# EasyEDA Pro project head_control.eprj, schematic Schematic1
Board Name: Board1; Create Date: 2025-10-14; Page Name: Core; Project Name: head_control; Schematic Name: Schematic1; Update Date: 2025-11-11; Company: 嘉立创EDA; Page Size: A4; Version: V1.0
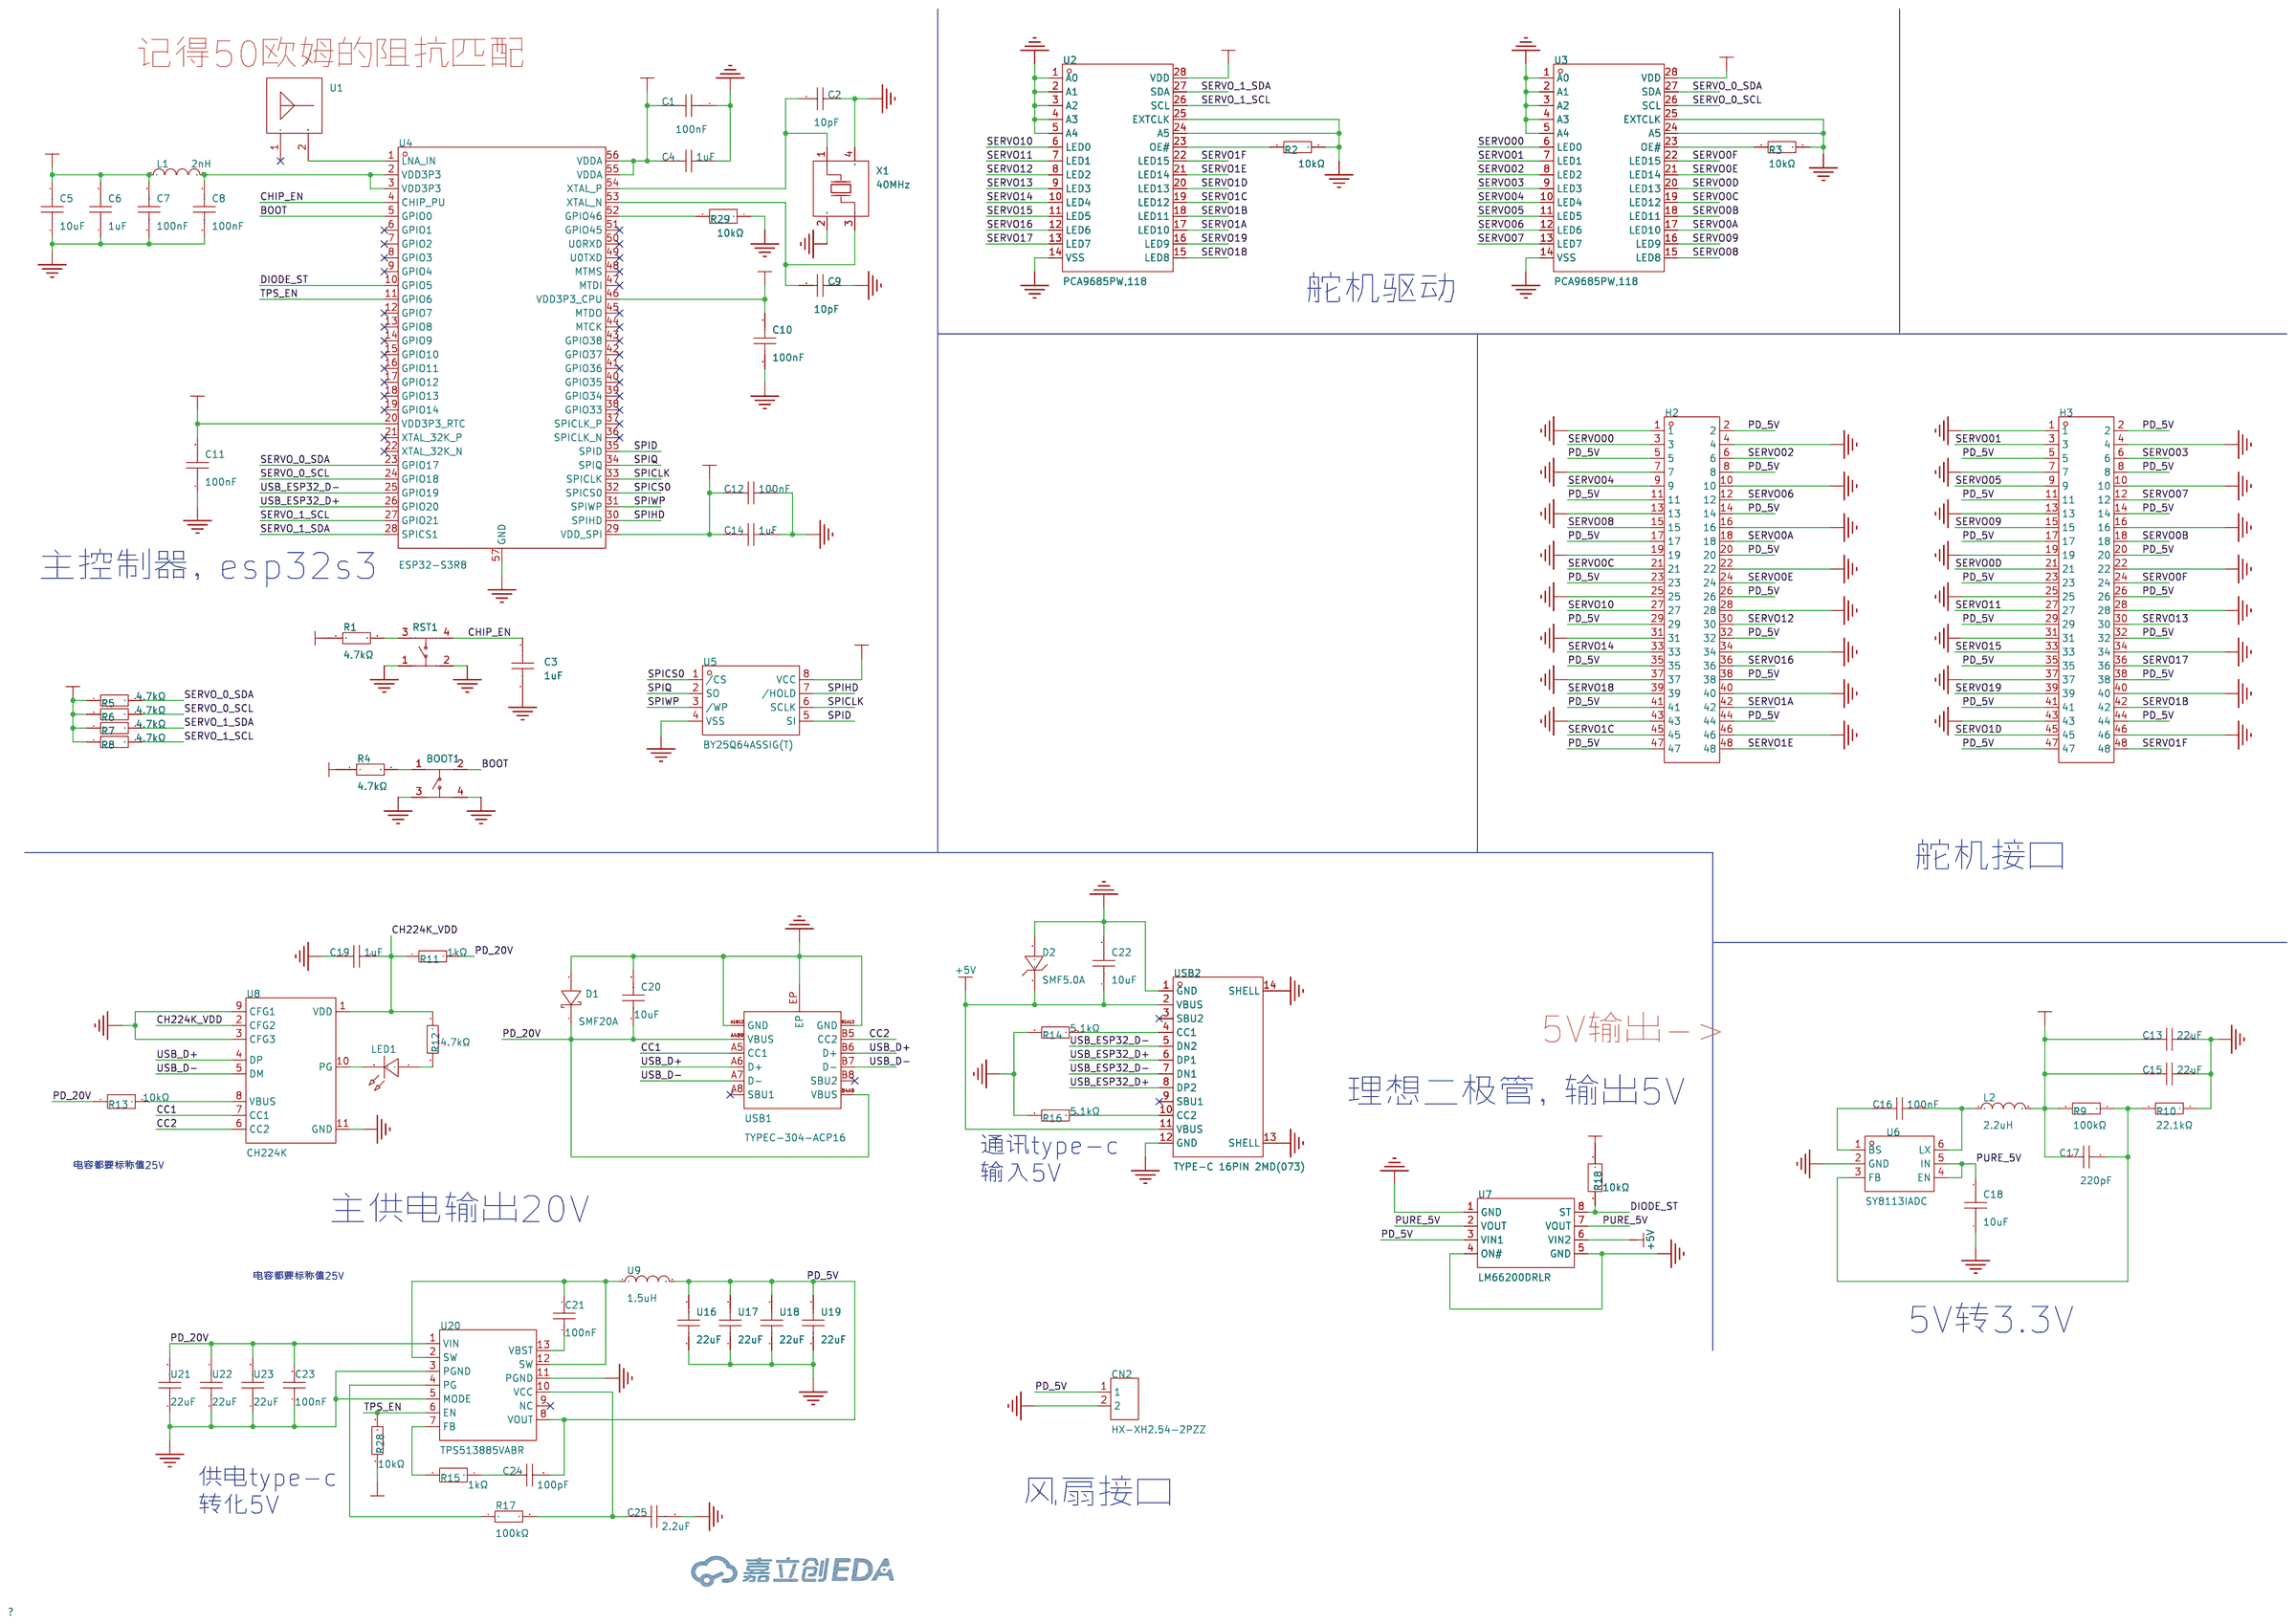
[diagram p0: schematic sheet]

## Parts
BOOT1  TSA016A2518A  [KEY-SMD_4P-L4.2-W3.4-P2.15-LS4.5-TL]
C1  100nF  [C0603]
C2  10pF  [C0603]
C3  1uF  [C0603]
C4  1uF  [C0603]
C5  10uF  [C0603]
C6  1uF  [C0603]
C7  100nF  [C0603]
C8  100nF  [C0603]
C9  10pF  [C0603]
C10  100nF  [C0603]
C11  100nF  [C0603]
C12  100nF  [C0603]
C13  22uF  [C0603]
C14  1uF  [C0603]
C15  22uF  [C0603]
C16  100nF  [C0603]
C17  220pF  [C0603]
C18  10uF  [C0603]
C19  1uF  [C0603]
C20  10uF  [C0603]
C21  100nF  [C0603]
C22  10uF  [C0603]
C23  100nF  [C0603]
C24  100pF  [C0603]
C25  2.2uF  [C0603]
CN2  HX-XH2.54-2PZZ  [CONN-TH_2P-P2.50_HX-2.54MM-2P-ZZ-MS]
D1  SMF20A  [SOD-123FL_L2.8-W1.9-LS3.7-RD]
D2  SMF5.0A  [SOD-123F_L2.8-W1.8-LS3.7-RD]
H2  KH-2.54PH180-3X16P-L11.5  [HDR-TH_48P-P2.54-V-M-R3-C16-S2.54_1]
H3  KH-2.54PH180-3X16P-L11.5  [HDR-TH_48P-P2.54-V-M-R3-C16-S2.54_1]
L1  2nH  [L0402]
L2  2.2uH  [IND-SMD_L2.5-W2.0_MHCHL2520]
LED1  SZYY0603R  [LED0603-R-RD]
R1  4.7kΩ  [R0603]
R2  10kΩ  [R0603]
R3  10kΩ  [R0603]
R4  4.7kΩ  [R0603]
R5  4.7kΩ  [R0603]
R6  4.7kΩ  [R0603]
R7  4.7kΩ  [R0603]
R8  4.7kΩ  [R0603]
R9  100kΩ  [R0603]
R10  22.1kΩ  [R0603]
R11  1kΩ  [R1206]
R12  4.7kΩ  [R0402]
R13  10kΩ  [R0603]
R14  5.1kΩ  [R0603]
R15  1kΩ  [R0603]
R16  5.1kΩ  [R0603]
R17  100kΩ  [R0603]
R18  10kΩ  [R0603]
R28  10kΩ  [R0603]
R29  10kΩ  [R0603]
RST1  TSA016A2518A  [KEY-SMD_4P-L4.2-W3.4-P2.15-LS4.5-TL]
U1  ADWH002  [ANT-SMD_L5.0-W2.0_HM5B]
U2  PCA9685PW,118  [TSSOP-28_L9.7-W4.4-P0.65-LS6.4-TL]
U3  PCA9685PW,118  [TSSOP-28_L9.7-W4.4-P0.65-LS6.4-TL]
U4  ESP32-S3R8  [QFN-56_L7.0-W7.0-P0.40-TL-EP4.0]
U5  BY25Q64ASSIG(T)  [SOIC-8_L5.3-W5.3-P1.27-LS8.0-BL]
U6  SY8113IADC  [TSOT-23-6_L2.9-W1.6-P0.95-LS2.8-BL]
U7  LM66200DRLR  [SOT-583-8_L2.1-W1.2-P0.50-LS1.6-BL]
U8  CH224K  [ESSOP-10_L4.9-W3.9-P1.0-LS6.0-TL-EP]
U9  1.5uH  [IND-SMD_L6.6-W6.4_FEXL0630A-1R5M]
U16  22uF  [C0603]
U17  22uF  [C0603]
U18  22uF  [C0603]
U19  22uF  [C0603]
U20  TPS513885VABR  [VQFN-HR-13_L4.0-W3.0_TPS51388VABR]
U21  22uF  [C0603]
U22  22uF  [C0603]
U23  22uF  [C0603]
USB1  TYPEC-304-ACP16  [USB-C-SMD_TYPE-C-16P-1]
USB2  TYPE-C 16PIN 2MD(073)  [USB-C-SMD_TYPE-C-6PIN-2MD-073]
X1  40MHz  [OSC-SMD_4P-L3.2-W2.5-BL_SIT8008BI]

## Library data of the parts
BOOT1 RST1 = TSA016A2518A: 触点电流:50mA;额定电压(AC):-;额定电压(DC):12V;安装方式:立贴;机械寿命:-;; LCSC Part Name: 4.2*3.35*2.5mm 立贴 轻触开关; Supplier Part: C2888427; Manufacturer: BZCN(博众电气); Supplier Footprint: SMD; JLCPCB Part Class: 扩展库; Datasheet: https://atta.szlcsc.com/upload/public/pdf/source/20210906/0198B859780D4FA617E4EB862D7350E5.pdf; Supplier: LCSC; Contact Current: 50mA; Voltage Rating (DC): 12V; Mounting Style: 立贴; Actuator Style: 椭圆形按钮; Switch Length: 4.2mm; Switch Width: 3.35mm; Switch Height: 2.5mm
C1 C7 C8 C10-C12 = CL10B104KB8NNNC: 容值:100nF;精度:±10%;额定电压:50V;材质(温度系数):X7R;; LCSC Part Name: 100nF ±10% 50V; Supplier Part: C1591; Manufacturer: SAMSUNG(三星); Supplier Footprint: 0603; JLCPCB Part Class: Extended Part; Datasheet: https://atta.szlcsc.com/upload/public/pdf/source/20160218/1457707763339.pdf; Supplier: LCSC; Tolerance: ±10%; Voltage Rated: 50V; Temperature Coefficient: X7R
C2 C9 = CL10C100JB8NNNC: 容值:10pF;精度:±5%;额定电压:50V;材质(温度系数):C0G;; LCSC Part Name: 10pF ±5% 50V; Supplier Part: C1634; Manufacturer: SAMSUNG(三星); Supplier Footprint: 0603; JLCPCB Part Class: 基础库; Datasheet: https://atta.szlcsc.com/upload/public/pdf/source/20160218/1457707763339.pdf; Supplier: LCSC; Tolerance: ±5%; Voltage Rated: 50V; Temperature Coefficient: C0G
C3 C4 C6 C14 = CL10A105KO8NNNC: 容值:1uF;精度:±10%;额定电压:16V;材质(温度系数):X5R;; LCSC Part Name: 1uF ±10% 16V; Supplier Part: C1592; Manufacturer: SAMSUNG(三星); Supplier Footprint: 0603; JLCPCB Part Class: Extended Part; Datasheet: https://atta.szlcsc.com/upload/public/pdf/source/20220919/9FBE606BE0D9532D730F292EB26DC5BB.pdf; Supplier: LCSC; Tolerance: ±10%; Voltage Rated: 16V; Temperature Coefficient: X5R
C5 C18 C22 = CL10A106KP8NNNC: 容值:10uF;精度:±10%;额定电压:10V;材质(温度系数):X5R;; LCSC Part Name: 10uF ±10% 10V; Supplier Part: C19702; Manufacturer: SAMSUNG(三星); Supplier Footprint: 0603; JLCPCB Part Class: Basic Part; Datasheet: https://atta.szlcsc.com/upload/public/pdf/source/20160218/1457707763339.pdf; Supplier: LCSC; Tolerance: ±10%; Voltage Rated: 10V; Temperature Coefficient: X5R
C13 C15 = CL10A226MQ8NRNC: LCSC Part Name: 22uF ±20% 6.3V; Supplier Part: C59461; Manufacturer: SAMSUNG(三星); Supplier Footprint: 0603; JLCPCB Part Class: 基础库; Datasheet: https://item.szlcsc.com/datasheet/CL10A226MQ8NRNC/60514.html; Supplier: LCSC; Tolerance: ±20%; Voltage Rating: 6.3V; Temperature Coefficient: X5R
C16 = CC0603KRX7R9BB104: LCSC Part Name: 100nF ±10% 50V; Supplier Part: C14663; Manufacturer: YAGEO(国巨); Supplier Footprint: 0603; JLCPCB Part Class: 基础库; Datasheet: https://item.szlcsc.com/datasheet/CC0603KRX7R9BB104/15331.html; Supplier: LCSC; Tolerance: ±10%; Voltage Rating: 50V; Temperature Coefficient: X7R
C17 = CL10B221KB8NNNC: LCSC Part Name: 220pF ±10% 50V; Supplier Part: C1603; Manufacturer: SAMSUNG(三星); Supplier Footprint: 0603; JLCPCB Part Class: 基础库; Datasheet: https://item.szlcsc.com/datasheet/CL10B221KB8NNNC/1955.html; Supplier: LCSC; Tolerance: ±10%; Voltage Rating: 50V; Temperature Coefficient: X7R
C19 = CL10B105KA8NNNC: LCSC Part Name: 1uF ±10% 25V; Supplier Part: C29936; Manufacturer: SAMSUNG(三星); Supplier Footprint: 0603; JLCPCB Part Class: 扩展库; Datasheet: https://item.szlcsc.com/datasheet/CL10B105KA8NNNC/30690.html; Supplier: LCSC; Tolerance: ±10%; Voltage Rating: 25V; Temperature Coefficient: X7R
C20 = CL10A106MA8NRNC: LCSC Part Name: 10uF ±20% 25V; Supplier Part: C96446; Manufacturer: SAMSUNG(三星); Supplier Footprint: 0603; JLCPCB Part Class: 基础库; Datasheet: https://item.szlcsc.com/datasheet/CL10A106MA8NRNC/97651.html; Supplier: LCSC; Tolerance: ±20%; Voltage Rating: 25V; Temperature Coefficient: X5R
C21 C23 = CL10B104KA8NNNC: LCSC Part Name: 100nF ±10% 25V; Supplier Part: C1590; Manufacturer: SAMSUNG(三星); Supplier Footprint: 0603; JLCPCB Part Class: 扩展库; Datasheet: https://item.szlcsc.com/datasheet/CL10B104KA8NNNC/1942.html; Supplier: LCSC; Tolerance: ±10%; Voltage Rating: 25V; Temperature Coefficient: X7R
C24 = CL10C101JB8NNNC: LCSC Part Name: 100pF ±5% 50V; Supplier Part: C14858; Manufacturer: SAMSUNG(三星); Supplier Footprint: 0603; JLCPCB Part Class: 基础库; Datasheet: https://item.szlcsc.com/datasheet/CL10C101JB8NNNC/15530.html; Supplier: LCSC; Tolerance: ±5%; Voltage Rating: 50V; Temperature Coefficient: C0G
C25 = CL10A225KB8NNNC: LCSC Part Name: 2.2uF ±10% 50V; Supplier Part: C913904; Manufacturer: SAMSUNG(三星); Supplier Footprint: 0603; JLCPCB Part Class: 扩展库; Datasheet: https://item.szlcsc.com/datasheet/CL10A225KB8NNNC/984470.html; Supplier: LCSC; Tolerance: ±10%; Voltage Rating: 50V; Temperature Coefficient: X5R
CN2 = HX-XH2.54-2PZZ: LCSC Part Name: 1x2P 间距:2.5mm 直插 系列:XH; Supplier Part: C42391660; Manufacturer: hanxia(韩下); Supplier Footprint: 插件,P=2.5mm; JLCPCB Part Class: 扩展库; Datasheet: https://item.szlcsc.com/datasheet/HX-XH2.54-2PZZ/44326932.html; Supplier: LCSC; Pins Structure: 1x2P; Pitch: 2.54mm; Mounting Type: 直插; Reference Series: XH; Number of Pins: 2P; Number of Rows: 1; Number of PINs Per Row: 2; Current Rating: 3A; Contact Material: 黄铜; Contact Plating: 锡; Operating Temperature: -25℃~+85℃; Voltage Rating: 250V; Plastic Material: PA66; Flame Retardant Rating: UL94V-0; Color: 白色
D1 = SMF20A_C41411782: LCSC Part Name: 单向TVS 20V截止 峰值浪涌电流：6.2A; Supplier Part: C41411782; Manufacturer: R+O(宏嘉诚); Supplier Footprint: SOD-123FL; JLCPCB Part Class: 扩展库; Datasheet: https://item.szlcsc.com/datasheet/SMF20A/43223725.html; Supplier: LCSC; Polarity: 单向; Reverse Stand-Off Voltage (Vrwm): 20V; Clamping Voltage: 32.4V; Peak Pulse Current (Ipp): 6.2A; Peak Pulse Power Dissipation (Ppp): 200W; Voltage - Breakdown: 24.5V; Reverse Leakage Current (Ir): 1uA; Operating Temperature: -55℃~+150℃; level of protection: IEC 61000-4-2; Type: TVS
D2 = SMF5.0A_C151296: 反向截止电压(Vrwm):5V;最大钳位电压:9.2V;峰值脉冲电流(Ipp)@10/1000us:21.7A;峰值脉冲功率(Ppp)@10/1000us:200W;击穿电压:6.4V;; Supplier Part: C151296; Manufacturer: Littelfuse(美国力特); Supplier Footprint: SOD-123; JLCPCB Part Class: 扩展库; Datasheet: https://atta.szlcsc.com/upload/public/pdf/source/20171201/C151298_15121179413071156555.pdf; Supplier: LCSC; Reverse Stand-Off Voltage (Vrwm): 5V; Maximum Clamping Voltage: 9.2V; Peak Pulse Current (Ipp)@10/1000us: 21.7A; Peak Pulse Power Dissipation (Ppp)@10/1000us: 200W; Breakdown Voltage: 6.4V; Type: TVS
H2 H3 = KH-2.54PH180-3X16P-L11.5: LCSC Part Name: 3x16P 间距:2.54mm 方针 直插; Supplier Part: C20610263; Manufacturer: kinghelm(金航标); Supplier Footprint: 插件,P=2.54mm; JLCPCB Part Class: 扩展库; Datasheet: https://item.szlcsc.com/datasheet/KH-2.54PH180-3X16P-L11.5/21960908.html; Supplier: LCSC; Pin Structure: 3x16P; Pitch: 2.54mm; Row Spacing: 2.54mm; Circluar Pins/Square Pins: 方针; Mounting Type: 直插; Number of Rows: 三排; Number of Pins: 48P; Current Rating: 3A; Length of Mating Pin: 6mm; Insulation Height: 2.5mm; Length of End Connection Pin: 3mm; Contact Material: 铜合金; Contact Plating: 金; Operating Temperature: -40℃~+105℃; Color: 黑色
L1 = MLG1005S2N0BT000: LCSC Part Name: ±0.1nH 2nH; Supplier Part: C76769; Manufacturer: TDK; Supplier Footprint: 0402; JLCPCB Part Class: 扩展库; Datasheet: https://atta.szlcsc.com/upload/public/pdf/source/20240116/5498F69597B6145D9954BDAE22913204.pdf; Supplier: LCSC; Current Rating: 900mA; DC Resistance(DCR): 70mΩ; Q @ Frequency: 7@100MHz; Frequency - Self Resonant: 7.5GHz
L2 = FTC252012S2R2MBCA: LCSC Part Name: 2.2uH ±20% 3.8A; Supplier Part: C5832372; Manufacturer: cjiang(长江微电); Supplier Footprint: 1008; JLCPCB Part Class: 扩展库; Datasheet: https://atta.szlcsc.com/upload/public/pdf/source/20230602/8FFEDA9C0247A92A0D4B67554BFE4091.pdf; Supplier: LCSC; Tolerance: ±20%; Rated Current: 3A; Saturation Current (Isat): 3.8A; DC Resistance (DCR): 55mΩ; Type: 一体成型电感
LED1 = SZYY0603R: 发光颜色:红色;功率:40mW;正向电流:20mA;主波长:615nm~630nm;二极管配置:-;透镜颜色:无色透明透镜;色温:-;发光角度:120°;载带方式:-;工作温度:-40℃~+85℃;; LCSC Part Name: 红灯; Supplier Part: C434419; Manufacturer: yongyu(永裕光电); Supplier Footprint: 0603; JLCPCB Part Class: Extended Part; Datasheet: https://atta.szlcsc.com/upload/public/pdf/source/20191204/C434419_0B955C1F73FF88449D9A795B6FF49070.pdf; Supplier: LCSC; Emitted Color: 红色; Power Dissipation: 40mW; Forward Current: 20mA; Dominant Wavelength: 615nm~630nm; Peak Wavelength: 645nm; Lens Color: 无色透明透镜; Viewing Angle: 120°; Operating Temperature: -40℃~+85℃
R1 R4-R8 = 0603WAF4701T5E: LCSC Part Name: 4.7kΩ ±1% 100mW 厚膜电阻; Supplier Part: C23162; Manufacturer: UNI-ROYAL(厚声); Supplier Footprint: 0603; JLCPCB Part Class: 基础库; Datasheet: https://item.szlcsc.com/datasheet/0603WAF4701T5E/23889.html; Supplier: LCSC; Type: 厚膜电阻; Tolerance: ±1%; Power(Watts): 100mW; Voltage-Supply(Max): 75V; Temperature Coefficient: ±100ppm/℃; Operating Temperature: -55℃~+155℃
R2 R3 R28 = 0603WAF1002T5E: LCSC Part Name: 厚膜电阻 10kΩ ±1% 100mW; Supplier Part: C25804; Manufacturer: UNI-ROYAL(厚声); Supplier Footprint: 0603; JLCPCB Part Class: 基础库; Datasheet: https://item.szlcsc.com/datasheet/0603WAF1002T5E/26547.html; Supplier: LCSC; Type: 厚膜电阻; Tolerance: ±1%; Power(Watts): 100mW; Voltage-Supply(Max): 75V; Temperature Coefficient: ±100ppm/℃; Operating Temperature: -55℃~+155℃
R9 = QR0603F100KP05Z: LCSC Part Name: 厚膜电阻 100kΩ ±1% 100mW; Supplier Part: C176150; Manufacturer: EVER OHMS(天二科技); Supplier Footprint: 0603; JLCPCB Part Class: 扩展库; Datasheet: https://atta.szlcsc.com/upload/public/pdf/source/20190816/C191725_FB5BDDD87CE7DE7F0F741FE894220CBC.pdf; Supplier: LCSC; Type: 厚膜电阻; Tolerance: ±1%; Power(Watts): 100mW; Voltage-Supply(Max): 75V; Temperature Coefficient: ±100ppm/℃; Operating Temperature: -55℃~+155℃
R10 = 0603WAF2212T5E: LCSC Part Name: 22.1kΩ ±1% 100mW 厚膜电阻; Supplier Part: C25961; Manufacturer: UNI-ROYAL(厚声); Supplier Footprint: 0603; JLCPCB Part Class: 扩展库; Datasheet: https://atta.szlcsc.com/upload/public/pdf/source/20200306/C422600_1E6D84923E4A46A82E41ADD87F860B5C.pdf; Supplier: LCSC; Type: 厚膜电阻; Tolerance: ±1%; Power(Watts): 100mW; Overload Voltage (Max): 75V; Temperature Coefficient: ±100ppm/℃; Operating Temperature Range: -55℃~+155℃
R11 = 1206W4F1001T5E_C4410: LCSC Part Name: 1kΩ ±1% 250mW 厚膜电阻; Supplier Part: C4410; Manufacturer: UNI-ROYAL(厚声); Manufacturer Part: 1206W4F1001T5E; Supplier Footprint: 1206; JLCPCB Part Class: 基础库; Datasheet: https://item.szlcsc.com/datasheet/1206W4F1001T5E/4817.html; Supplier: LCSC; Type: 厚膜电阻; Tolerance: ±1%; Power(Watts): 250mW; Voltage-Supply(Max): 200V; Temperature Coefficient: ±100ppm/℃; Operating Temperature: -55℃~+155℃
R12 = 0402WGJ0472TCE: 电阻类型:厚膜电阻;阻值:4.7kΩ;精度:±5%;功率:62.5mW;; LCSC Part Name: 4.7kΩ ±5% 62.5mW; Supplier Part: C25940; Manufacturer: UNI-ROYAL(厚声); Supplier Footprint: 0402; JLCPCB Part Class: 扩展库; Datasheet: https://atta.szlcsc.com/upload/public/pdf/source/20200306/C422600_1E6D84923E4A46A82E41ADD87F860B5C.pdf; Supplier: LCSC; Type: 厚膜电阻; Tolerance: ±5%; Power(Watts): 62.5mW; Temperature Coefficient: ±100ppm/℃; Overload Voltage (Max): 50V; Operating Temperature Range: -55℃~+155℃
R13 R18 = RCA0310KJLF: LCSC Part Name: 10kΩ ±5% 100mW; Supplier Part: C22369937; Manufacturer: HKR(香港电阻); Supplier Footprint: 0603; JLCPCB Part Class: 扩展库; Datasheet: https://item.szlcsc.com/datasheet/RCA0310KJLF/23848968.html; Supplier: LCSC; Tolerance: ±5%; Power(Watts): 100mW
R14 R16 = 0603WAF5101T5E: 电阻类型:厚膜电阻;阻值:5.1kΩ;精度:±1%;功率:100mW;最大工作电压:75V;温度系数:±100ppm/℃;; LCSC Part Name: 5.1kΩ ±1% 100mW 厚膜电阻; Supplier Part: C23186; Manufacturer: UNI-ROYAL(厚声); Supplier Footprint: 0603; JLCPCB Part Class: 基础库; Datasheet: https://atta.szlcsc.com/upload/public/pdf/source/20200306/C422600_1E6D84923E4A46A82E41ADD87F860B5C.pdf; Supplier: LCSC; Type: 厚膜电阻; Tolerance: ±1%; Power(Watts): 100mW; Overload Voltage (Max): 75V; Temperature Coefficient: ±100ppm/℃; Operating Temperature Range: -55℃~+155℃
R15 = FRC0603F1001TS: LCSC Part Name: 1kΩ ±1% 100mW 厚膜电阻; Supplier Part: C2907002; Manufacturer: FOJAN(富捷); Supplier Footprint: 0603; JLCPCB Part Class: 扩展库; Supplier: LCSC; Type: 厚膜电阻; Tolerance: ±1%; Power(Watts): 100mW; Voltage-Supply(Max): 75V; Temperature Coefficient: ±100ppm/℃; Operating Temperature: -55℃~+155℃
R17 = ERJ3EKF1003V: LCSC Part Name: 100kΩ ±1% 100mW 厚膜电阻; Supplier Part: C189597; Manufacturer: PANASONIC(松下); Supplier Footprint: 0603; JLCPCB Part Class: 扩展库; Datasheet: https://item.szlcsc.com/datasheet/ERJ3EKF1003V/201577.html; Supplier: LCSC; Type: 厚膜电阻; Tolerance: ±1%; Power(Watts): 100mW; Temperature Coefficient: ±100ppm/℃; Operating Temperature: -55℃~+155℃
R29 = RC1608F103CS: 电阻类型:厚膜电阻;阻值:10kΩ;精度:±1%;功率:100mW;温度系数:±100ppm/℃;; LCSC Part Name: 厚膜电阻 10kΩ ±1% 100mW; Supplier Part: C17441167; Manufacturer: SAMSUNG(三星); Supplier Footprint: 0603; JLCPCB Part Class: 扩展库; Datasheet: https://atta.szlcsc.com/upload/public/pdf/source/20210602/455D0E07AED06E76D0C921B8CB06E528.pdf; Supplier: LCSC; Type: 厚膜电阻; Tolerance: ±1%; Power(Watts): 100mW; Temperature Coefficient: ±100ppm/℃; Operating Temperature Range: -55℃~+155℃
U1 = ADWH002: 天线类型:-;中心频率:2.45GHz;带宽:100MHz;增益:0.67dBi;功率:3W;驻波比:2;; LCSC Part Name: 2.4GHz SMD贴片天线 蓝牙/WiFi/zigbee芯片天线 大款; Supplier Part: C22467691; Manufacturer: MyAntenna(摩天射频); Supplier Footprint: SMD; JLCPCB Part Class: 扩展库; Datasheet: https://atta.szlcsc.com/upload/public/pdf/source/20240625/D215ED83B6453DB4ED1D0491E177A9EC.pdf; Supplier: LCSC; Frequency(Center/Band): 2.45GHz; Bandwidth: 100MHz; Peak Gain: 0.67dBi; Impedance: 50Ω; Power: 3W; VSWR: 2; Operating Temperature: -40℃~+85℃
U2 U3 = PCA9685PW,118: LCSC Part Name: 16通道、12位PWM Fm+ I2C总线LED控制器; Supplier Part: C2678753; Manufacturer: NXP(恩智浦); Supplier Footprint: TSSOP-28; JLCPCB Part Class: 扩展库; Datasheet: https://www.nxp.com.cn/docs/en/data-sheet/PCA9685.pdf; Supplier: LCSC; Voltage - Input(DC): 2.3V~5.5V; Frequency - Switching: 100kHz~1MHz; Number of Channels: 16; Output Current: 25mA; Dimming: PWM; Operating temperature: -40℃~+85℃
U4 = ESP32-S3R8: Supplier Part: C2913194; Manufacturer: ESPRESSIF(乐鑫); Supplier Footprint: QFN-56(7x7); JLCPCB Part Class: 扩展库; Datasheet: https://item.szlcsc.com/datasheet/ESP32-S3R8/3198292.html; Supplier: LCSC; Frequency Range: 2.412GHz~2.484GHz; Interface: I2C；I2S；UART；USB；SPI; Voltage - Supply: 3V~3.6V; Applications: 蓝牙；IoT；WiFi; Output Power: 18.5dBm; Data Rate: 150Mbps; Current Of Transmitting: 283mA; Sensitivity: -74.2dBm; Receive Current: 88mA; Typical Application Frequency: 2.4GHz; Operating Temperature: -40℃~+65℃
U5 = BY25Q64ASSIG(T): LCSC Part Name: 64Mbit SPI NOR闪存; Supplier Part: C484306; Manufacturer: BOYAMICRO(博雅); Supplier Footprint: SOIC-8-208mil; JLCPCB Part Class: 扩展库; Datasheet: https://item.szlcsc.com/datasheet/BY25Q64ASSIG(T)/492471.html; Supplier: LCSC; Interface: SPI; Memory Size: 64Mbit; Clock Frequency: 108MHz; Voltage - Supply: 2.7V~3.6V; Standby Supply Current: 5uA; Program / Erase Cycles: 100000次; Page Programming Time (Tpp): 600us; Data Retention - TDR (Year): 20年
U6 = SY8113IADC: LCSC Part Name: 高效3A 18V输入同步降压DC/DC调节器; Supplier Part: C479075; Manufacturer: silergy(矽力杰); Supplier Footprint: TSOT-23-6; JLCPCB Part Class: 扩展库; Datasheet: https://atta.szlcsc.com/upload/public/pdf/source/20200117/C479075_749CE19A0276D274B25CFED6D9E6F64F.pdf; Supplier: LCSC; Function: 降压型; Output Type: 固定; Input Voltage: 4.2V~18V; Output Voltage: 3.3V; Output Current: 3A; Switching Frequency: 500kHz; Operating Temperature: -40℃~+125℃; Synchronous Rectification: 是; Number of Outputs: 1; Topology: 降压式; Quiescent Current (Iq): 609uA; Switch tube (built-in/external): 内置
U7 = LM66200DRLR: Supplier Part: C3235556; Manufacturer: TI(德州仪器); Supplier Footprint: SOT-583; JLCPCB Part Class: 扩展库; Datasheet: https://www.ti.com/cn/lit/gpn/lm66200; Supplier: LCSC; Input Voltage (Vin): 1.6V~5.5V; Number of Channels: 2; RDS(on): 74mΩ; Quiescent Current: 1.32uA; Operating Temperature: -40℃~+125℃
U8 = CH224K: LCSC Part Name: USBPD等多快充协议受电芯片CH224; Supplier Part: C970725; Manufacturer: WCH(南京沁恒); Supplier Footprint: ESSOP-10-150mil-1mm; JLCPCB Part Class: 扩展库; Datasheet: https://item.szlcsc.com/datasheet/CH224K/1060460.html; Supplier: LCSC
U9 = FEXL0630A-1R5M: LCSC Part Name: 1.5uH ±20% 20A 合金扁线超大电流，一体成型电感; Supplier Part: C5378526; Manufacturer: cjiang(长江微电); Supplier Footprint: SMD,6.6x6.4mm; JLCPCB Part Class: 扩展库; Datasheet: https://atta.szlcsc.com/upload/public/pdf/source/20240409/B9FA7ECCC3220F3F7C7BE8F7B1FCE238.pdf; Supplier: LCSC; Tolerance: ±20%; Current Rating: 15A; Current - Saturation(Isat): 20A; DC Resistance(DCR): 9.13mΩ; Ratings: AEC-Q200
U16-U19 U21-U23 = GRM188C61E226ME01D: LCSC Part Name: 22uF ±20% 25V; Supplier Part: C29519229; Manufacturer: muRata(村田); Supplier Footprint: 0603; JLCPCB Part Class: 扩展库; Datasheet: https://item.szlcsc.com/datasheet/GRM188C61E226ME01D/31245821.html; Supplier: LCSC; Tolerance: ±20%; Voltage Rating: 25V
U20 = TPS513885VABR: Supplier Part: C41935536; Manufacturer: TI(德州仪器); Supplier Footprint: VQFN-HR-13(3x4); JLCPCB Part Class: 扩展库; Datasheet: https://www.ti.com.cn/cn/lit/ds/symlink/tps513885.pdf?ts=1736920133660; Supplier: LCSC
USB1 = TYPEC-304-ACP16: LCSC Part Name: Type-C 母 卧贴; Supplier Part: C2982555; Manufacturer: XUNPU(讯普); Supplier Footprint: SMD; JLCPCB Part Class: 扩展库; Datasheet: https://item.szlcsc.com/datasheet/TYPEC-304-ACP16/3412817.html; Supplier: LCSC; Connector Type: Type-C; Gender: 母; Mounting Type: 卧贴; Number of Contacts: 16P; Number of Ports: 1; Current Rating-Power: 3A; Voltage Rating: 20V; Connect-Disconnect Life: 1万次; Length: 7.35mm; Detection color: 黑色; Operating Temperature: -40℃~+85℃
USB2 = TYPE-C 16PIN 2MD(073): 连接器类型:Type-C;协议标准:-;公母:母;安装方式:卧贴;触点数量:16P;端口数量:1;额定电流 - 电源:3A;工作温度:-25℃~+85℃;; LCSC Part Name: Type-C 母 卧贴; Supplier Part: C2765186; Manufacturer: SHOU HAN(首韩); Supplier Footprint: SMD; JLCPCB Part Class: 扩展库; Datasheet: https://item.szlcsc.com/datasheet/TYPE-C%252016PIN%25202MD(073)/2901843.html; Supplier: LCSC; Connector Type: Type-C; Gender: 母; Mounting Type: 卧贴; Number of Contacts: 16P; Number of Ports: 1; Current Rating-Power: 3A; Voltage Rating: 5V; Connect-Disconnect Life: 5千次; Detection color: 黑色; Operating Temperature: -25℃~+85℃
X1 = X322540MPB4SI: 频率:40MHz;频率公差:±10ppm;负载电容:15pF;; LCSC Part Name: 40MHz ±10ppm 15pF YSX321SL; Supplier Part: C9010; Manufacturer: YXC(扬兴晶振); Supplier Footprint: SMD3225-4P; JLCPCB Part Class: 扩展库; Datasheet: https://atta.szlcsc.com/upload/public/pdf/source/20210329/C112971_1F611BDC486E193C1706F6D8EB5AA189.pdf; Supplier: LCSC; Crystal Type: 贴片无源晶振; Frequency Tolerance: ±10ppm; Frequency Stability: ±30ppm; Load Capacitance: 15pF; Operating Temperature: -40℃~+85℃

## Nets
3V3: C1.2 C4.2 C5.2 C6.2 C7.2 C10.2 C11.2 C13.1 C15.1 C17.1 L1.1 L2.2 R1.1 R4.1 R5.1 R6.1 R7.1 R8.1 R9.2 R18.2 R28.1 U2.28(VDD) U3.28(VDD) U4.20(VDD3P3_RTC) U4.46(VDD3P3_CPU) U4.55(VDDA) U4.56(VDDA)
+5V: C22.1 D2.1 U7.6(VIN2) USB2.2(VBUS) USB2.11(VBUS)
GND: BOOT1.3 BOOT1.4 C1.1 C2.2 C3.2 C4.1 C5.1 C6.1 C7.1 C8.1 C9.2 C10.1 C11.1 C12.1 C13.2 C14.2 C15.2 C18.1 C19.2 C20.2 C22.2 C23.1 C25.2 CN2.2 D1.2(A) D2.2 H2.1 H2.4 H2.7 H2.10 H2.13 H2.16 H2.19 H2.22 H2.25 H2.28 H2.31 H2.34 H2.37 H2.40 H2.43 H2.46 H3.1 H3.4 H3.7 H3.10 H3.13 H3.16 H3.19 H3.22 H3.25 H3.28 H3.31 H3.34 H3.37 H3.40 H3.43 H3.46 R2.2 R3.2 R10.2 R14.2 R16.2 R29.1 RST1.1 RST1.2 U2.1(A0) U2.2(A1) U2.3(A2) U2.4(A3) U2.5(A4) U2.14(VSS) U2.24(A5) U2.25(EXTCLK) U3.1(A0) U3.2(A1) U3.3(A2) U3.4(A3) U3.5(A4) U3.14(VSS) U3.24(A5) U3.25(EXTCLK) U4.57(GND) U5.4(VSS) U6.2(GND) U7.1(GND) U7.4(ON#) U7.5(GND) U8.3(CFG3) U8.9(CFG1) U8.11(GND) U16.1 U17.1 U18.1 U19.1 U20.3(PGND) U20.5(MODE) U20.11(PGND) U21.1 U22.1 U23.1 USB1.A1B12(GND) USB1.B1A12(GND) USB1.EP USB2.1(GND) USB2.12(GND) USB2.13(SHELL) USB2.14(SHELL) X1.2(GND) X1.4(GND)
VDD_SPI: C12.2 C14.1 U4.29(VDD_SPI) U5.8(VCC)
BOOT: BOOT1.2 U4.5(GPIO0)
CC1: U8.7(CC1) USB1.A5(CC1)
CC2: U8.6(CC2) USB1.B5(CC2)
CH224K_VDD: C19.1 R11.1 R12.1 U8.1(VDD) U8.2(CFG2)
CHIP_EN: C3.1 RST1.4 U4.4(CHIP_PU)
DIODE_ST: R18.1 U4.10(GPIO5) U7.8(ST)
PD_5V: C24.2 CN2.1 H2.2 H2.5 H2.8 H2.11 H2.14 H2.17 H2.20 H2.23 H2.26 H2.29 H2.32 H2.35 H2.38 H2.41 H2.44 H2.47 H3.2 H3.5 H3.8 H3.11 H3.14 H3.17 H3.20 H3.23 H3.26 H3.29 H3.32 H3.35 H3.38 H3.41 H3.44 H3.47 U7.3(VIN1) U9.2 U16.2 U17.2 U18.2 U19.2 U20.8(VOUT)
PD_20V: C20.1 C23.2 D1.1(K) R11.2 R13.1 U20.1(VIN) U21.2 U22.2 U23.2 USB1.A4B9(VBUS) USB1.B4A9(VBUS)
PURE_5V: C18.2 U6.4(EN) U6.5(IN) U7.2(VOUT) U7.7(VOUT)
SERVO00: H2.3 U3.6(LED0)
SERVO0A: H2.18 U3.17(LED10)
SERVO0B: H3.18 U3.18(LED11)
SERVO0C: H2.21 U3.19(LED12)
SERVO0D: H3.21 U3.20(LED13)
SERVO0E: H2.24 U3.21(LED14)
SERVO0F: H3.24 U3.22(LED15)
SERVO01: H3.3 U3.7(LED1)
SERVO1A: H2.42 U2.17(LED10)
SERVO1B: H3.42 U2.18(LED11)
SERVO1C: H2.45 U2.19(LED12)
SERVO1D: H3.45 U2.20(LED13)
SERVO1E: H2.48 U2.21(LED14)
SERVO1F: H3.48 U2.22(LED15)
SERVO02: H2.6 U3.8(LED2)
SERVO03: H3.6 U3.9(LED3)
SERVO04: H2.9 U3.10(LED4)
SERVO05: H3.9 U3.11(LED5)
SERVO06: H2.12 U3.12(LED6)
SERVO07: H3.12 U3.13(LED7)
SERVO08: H2.15 U3.15(LED8)
SERVO09: H3.15 U3.16(LED9)
SERVO10: H2.27 U2.6(LED0)
SERVO11: H3.27 U2.7(LED1)
SERVO12: H2.30 U2.8(LED2)
SERVO13: H3.30 U2.9(LED3)
SERVO14: H2.33 U2.10(LED4)
SERVO15: H3.33 U2.11(LED5)
SERVO16: H2.36 U2.12(LED6)
SERVO17: H3.36 U2.13(LED7)
SERVO18: H2.39 U2.15(LED8)
SERVO19: H3.39 U2.16(LED9)
SERVO_0_SCL: R6.2 U3.26(SCL) U4.24(GPIO18)
SERVO_0_SDA: R5.2 U3.27(SDA) U4.23(GPIO17)
SERVO_1_SCL: R8.2 U2.26(SCL) U4.27(GPIO21)
SERVO_1_SDA: R7.2 U2.27(SDA) U4.28(SPICS1)
SPICLK: U4.33(SPICLK) U5.6(SCLK)
SPICS0: U4.32(SPICS0) U5.1(/CS)
SPID: U4.35(SPID) U5.5(SI)
SPIHD: U4.30(SPIHD) U5.7(/HOLD)
SPIQ: U4.34(SPIQ) U5.2(SO)
SPIWP: U4.31(SPIWP) U5.3(/WP)
TPS_EN: R28.2 U4.11(GPIO6) U20.6(EN)
USB_D+: U8.4(DP) USB1.A6(D+) USB1.B6(D+)
USB_D-: U8.5(DM) USB1.A7(D-) USB1.B7(D-)
USB_ESP32_D+: U4.26(GPIO20) USB2.6(DP1) USB2.8(DP2)
USB_ESP32_D-: U4.25(GPIO19) USB2.5(DN2) USB2.7(DN1)
$1N1648: C9.1 U4.53(XTAL_N) X1.3(OSC2)
$1N1650: C2.1 U4.54(XTAL_P) X1.1(OSC1)
$1N1654: U1.2(GND) U4.1(LNA_IN)
$1N1665: C8.2 L1.2 U4.2(VDD3P3) U4.3(VDD3P3)
$1N7101: R16.1 USB2.10(CC2)
$1N7103: R14.1 USB2.4(CC1)
$1N12657: BOOT1.1 R4.2
$1N15070: R1.2 RST1.3
$1N15501: R13.2 U8.8(VBUS)
$1N15512: LED1.2 U8.10(PG)
$1N15982: R3.1 U3.23(OE#)
$1N15983: R2.1 U2.23(OE#)
$1N16437: C16.1 U6.1(BS)
$1N16446: C16.2 L2.1 U6.6(LX)
$1N19020: C17.2 R9.1 R10.1 U6.3(FB)
$1N31983: C21.2 U9.1 U20.2(SW) U20.12(SW)
$1N32212: C21.1 U20.13(VBST)
$1N32303: R15.2 U20.7(FB)
$1N32377: C24.1 R15.1
$1N32486: C25.1 R17.2 U20.10(VCC)
$1N32507: R17.1 U20.4(PG)
$1N35893: LED1.1 R12.2
$1N42882: R29.2 U4.52(GPIO46)

Not connected (* = marked no-connect by the designer): U1 1(IN)*; U4 6(GPIO1)* 7(GPIO2)* 8(GPIO3)* 9(GPIO4)* 12(GPIO7)* 13(GPIO8)* 14(GPIO9)* 15(GPIO10)* 16(GPIO11)* 17(GPIO12)* 18(GPIO13)* 19(GPIO14)* 21(XTAL_32K_P)* 22(XTAL_32K_N)* 36(SPICLK_N)* 37(SPICLK_P)* 38(GPIO33)* 39(GPIO34)* 40(GPIO35)* 41(GPIO36)* 42(GPIO37)* 43(GPIO38)* 44(MTCK)* 45(MTDO)* 47(MTDI)* 48(MTMS)* 49(U0TXD)* 50(U0RXD)* 51(GPIO45)*; U20 9(NC)*; USB1 A8(SBU1)* B8(SBU2)*; USB2 3(SBU2)* 9(SBU1)*

## Notes on the sheet
- 记得50欧姆的阻抗匹配
- 舵机驱动
- 主控制器，esp32s3
- 舵机接口
- 5V输出->
- 理想二极管，输出5V
- 电容都要标称值25V
- 通讯type-c
  输入5V
- 主供电输出20V
- 电容都要标称值25V
- 5V转3.3V
- 供电type-c
  转化5V
- 风扇接口
